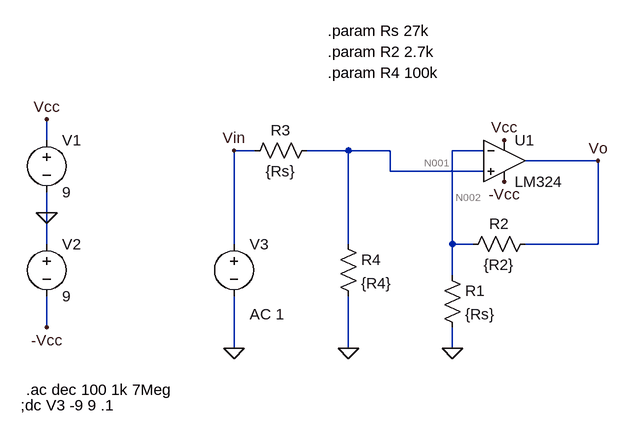
[diagram p0: schematic No_inversor_Caso3.asc]
* No_inversor_Caso3.asc
* U1: LM324 (symbol sympropio\LM324 not available, pins judged from their places): In+=N001 In-=N002 V+=Vcc V-=-Vcc OUT=Vo
V1 Vcc 0 9
V2 0 -Vcc 9
V3 Vin 0 AC 1
R3 N001 Vin {Rs}
R4 N001 0 {R4}
R1 N002 0 {Rs}
R2 Vo N002 {R2}
.param Rs 27k
.param R2 2.7k
.param R4 100k
.ac dec 100 1k 7Meg
;dc V3 -9 9 .1
.backanno
.end

* Results of the author's LTspice run, read from the files saved beside the schematic
* Operating Point, zero values left out:
*   V(vo) = 375 µV
*   V(-vcc) = -9 V
*   V(vcc) = 9 V
*   V(n002) = 389.9 µV
*   V(n001) = 423.6 µV
*   I(R2) = -5.5 nA
*   I(R1) = 14.44 nA
*   I(R4) = 4.236 nA
*   I(R3) = 15.69 nA
*   I(V3) = 15.69 nA
*   I(V2) = -603.8 µA
*   I(V1) = -603.9 µA
*   Ix(u1:1) = -19.92 nA
*   Ix(u1:2) = -19.94 nA
*   Ix(u1:3) = 603.9 µA
*   Ix(u1:4) = -603.8 µA
*   Ix(u1:5) = 5.5 nA
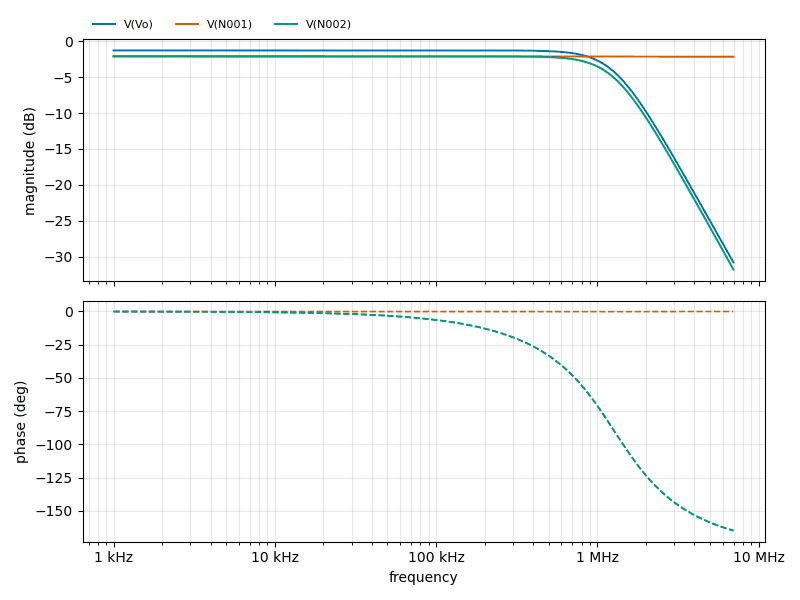
[diagram p1: AC Analysis of No_inversor_Caso3.asc, plotted from the saved traces]
* AC Analysis, 1 run:
*   V(Vo): -1.25 dB at 1 kHz, -30.85 dB at 7 MHz, peak -1.25 dB at 1 kHz, 3 dB below the peak at 1.273 MHz
*   V(N001): -2.08 dB at 1 kHz, -2.12 dB at 7 MHz, peak -2.08 dB at 1 kHz
*   V(N002): -2.08 dB at 1 kHz, -31.84 dB at 7 MHz, peak -2.08 dB at 1 kHz, 3 dB below the peak at 1.273 MHz